# EAGLE schematic PBC-1 (EAGLE 7.1.0)
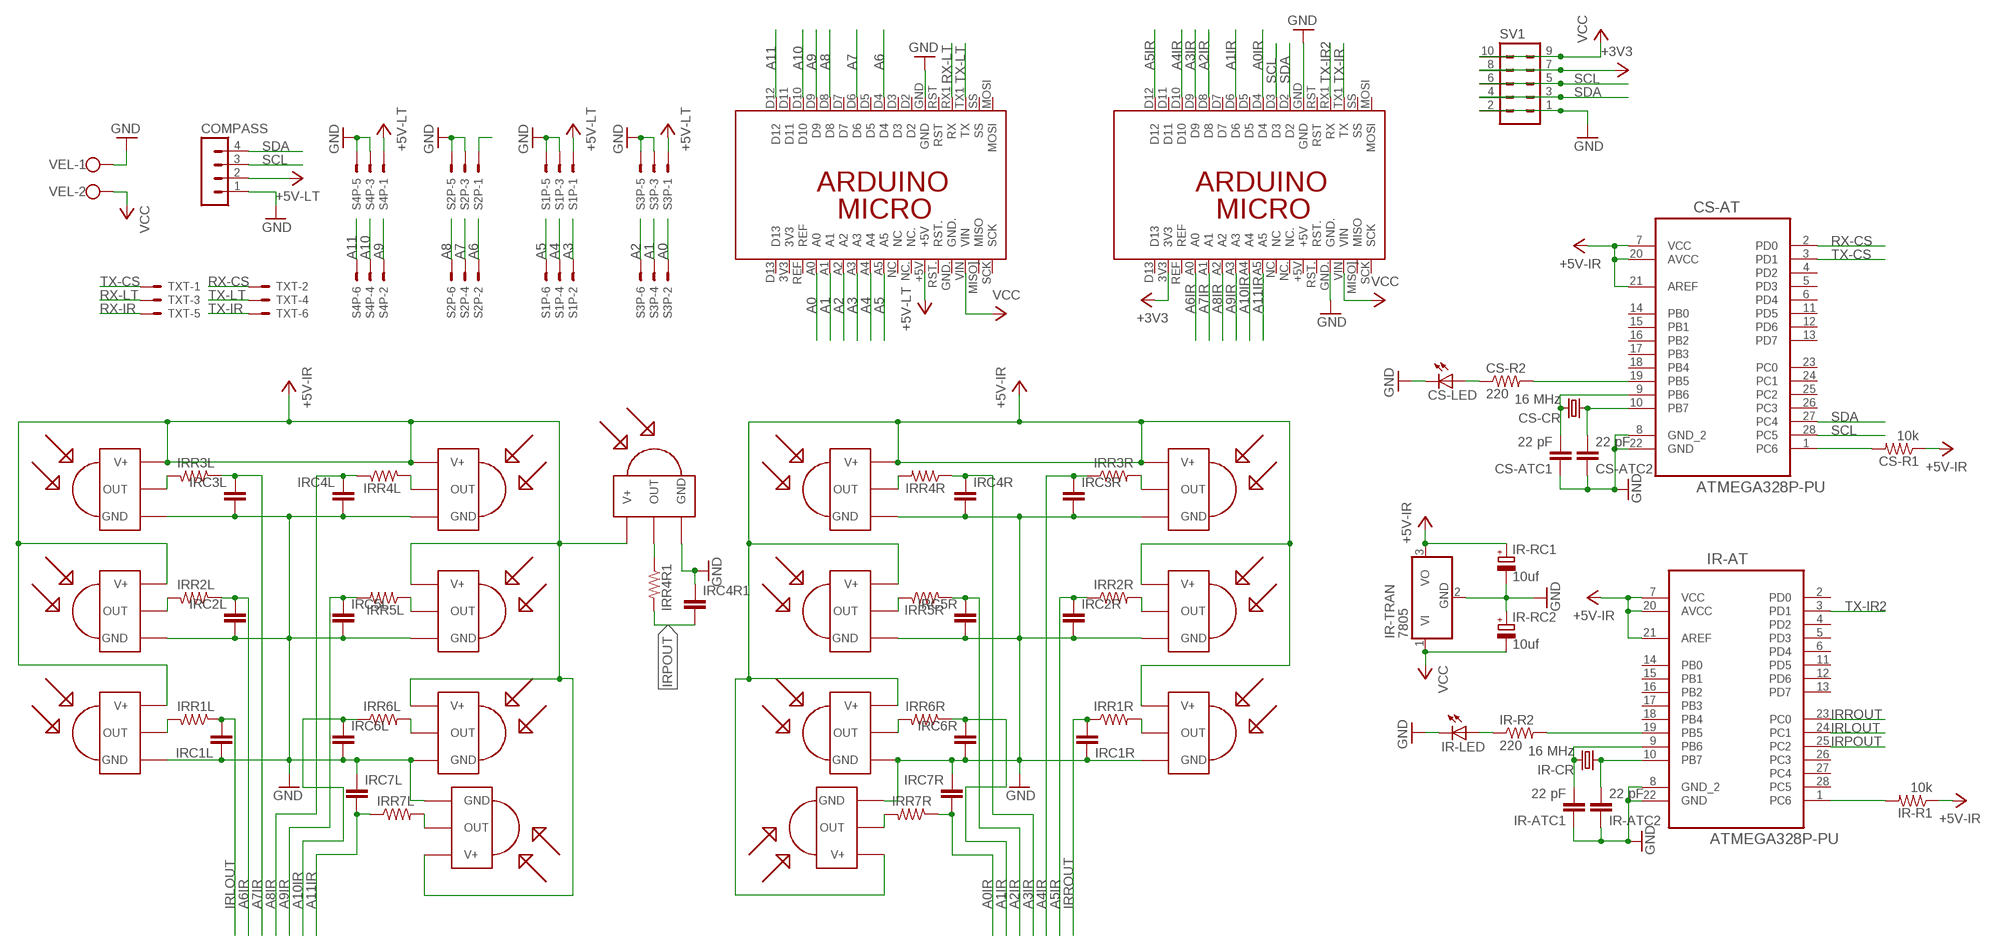
[diagram p0: schematic, sheet 1]

## Parts
COMPASS  MA04-1  [MA04-1]
CS-AT  ATMEGA328P-PU  [DIP254P762X457-28]
CS-ATC1  22 pF  C-EU025-024X044  [C025-024X044]
CS-ATC2  22 pF  C-EU025-024X044  [C025-024X044]
CS-CR  16 MHz  CRYSTALHC49U70  [HC49U70]
CS-LED  LED5MM  [LED5MM]
CS-R1  10k  R-US_0204/7  [0204/7]
CS-R2  220  R-US_0204/7  [0204/7]
IR-AT  ATMEGA328P-PU  [DIP254P762X457-28]
IR-ATC1  22 pF  C-EU025-024X044  [C025-024X044]
IR-ATC2  22 pF  C-EU025-024X044  [C025-024X044]
IR-CR  16 MHz  CRYSTALHC49U70  [HC49U70]
IR-LED  LED5MM  [LED5MM]
IR-R1  10k  R-US_0204/7  [0204/7]
IR-R2  220  R-US_0204/7  [0204/7]
IR-RC1  10uf  CPOL-EUTT2D5  [TT2D5]
IR-RC2  10uf  CPOL-EUTT2D5  [TT2D5]
IR-TRAN  7805  7805T  [TO220H]
IRC1L  C-EU025-024X044  [C025-024X044]
IRC1R  C-EU025-024X044  [C025-024X044]
IRC2L  C-EU025-024X044  [C025-024X044]
IRC2R  C-EU025-024X044  [C025-024X044]
IRC3L  C-EU025-024X044  [C025-024X044]
IRC3R  C-EU025-024X044  [C025-024X044]
IRC4L  C-EU025-024X044  [C025-024X044]
IRC4R  C-EU025-024X044  [C025-024X044]
IRC4R1  C-EU025-024X044  [C025-024X044]
IRC5L  C-EU025-024X044  [C025-024X044]
IRC5R  C-EU025-024X044  [C025-024X044]
IRC6L  C-EU025-024X044  [C025-024X044]
IRC6R  C-EU025-024X044  [C025-024X044]
IRC7L  C-EU025-024X044  [C025-024X044]
IRC7R  C-EU025-024X044  [C025-024X044]
IRD1L  TSOP2240  TSOP1840  [TSOP18XX]
IRD1R  TSOP2240  TSOP1840  [TSOP18XX]
IRD2L  TSOP2240  TSOP1840  [TSOP18XX]
IRD2R  TSOP2240  TSOP1840  [TSOP18XX]
IRD3L  TSOP2240  TSOP1840  [TSOP18XX]
IRD3R  TSOP1840  [TSOP18XX]
IRD4L  TSOP2240  TSOP1840  [TSOP18XX]
IRD4R  TSOP2240  TSOP1840  [TSOP18XX]
IRD5L  TSOP2240  TSOP1840  [TSOP18XX]
IRD5R  TSOP2240  TSOP1840  [TSOP18XX]
IRD6L  TSOP2240  TSOP1840  [TSOP18XX]
IRD6R  TSOP2240  TSOP1840  [TSOP18XX]
IRD7L  TSOP2240  TSOP1840  [TSOP18XX]
IRD7R  TSOP2240  TSOP1840  [TSOP18XX]
IRDP  TSOP2240  TSOP1840  [TSOP18XX]
IRR1L  R-US_0204/5  [0204/5]
IRR1R  R-US_0204/5  [0204/5]
IRR2L  R-US_0204/5  [0204/5]
IRR2R  R-US_0204/5  [0204/5]
IRR3L  R-US_0204/5  [0204/5]
IRR3R  R-US_0204/5  [0204/5]
IRR4L  R-US_0204/5  [0204/5]
IRR4R  R-US_0204/5  [0204/5]
IRR4R1  R-US_0204/5  [0204/5]
IRR5L  R-US_0204/5  [0204/5]
IRR5R  R-US_0204/5  [0204/5]
IRR6L  R-US_0204/5  [0204/5]
IRR6R  R-US_0204/5  [0204/5]
IRR7L  R-US_0204/5  [0204/5]
IRR7R  R-US_0204/5  [0204/5]
PCB1  ARDUINO_MICRO  [ARDUINO_MICRO]
PCB3  ARDUINO_MICRO  [ARDUINO_MICRO]
S1P  332-06  [332-06]
S2P  332-06  [332-06]
S3P  332-06  [332-06]
S4P  332-06  [332-06]
SV1  MA05-2  [MA05-2]
TXT  87758-0616  [87758-0616]
VEL  W237-102  [W237-102]

## Nets
+3V3: PCB3.3V3 SV1.7 SV1.8
+5V-IR: CS-AT.7(VCC) CS-AT.20(AVCC) CS-AT.21(AREF) CS-R1.1 IR-AT.7(VCC) IR-AT.20(AVCC) IR-AT.21(AREF) IR-R1.1 IR-RC1.+ IR-TRAN.3(VO) IRD1L.VCC(V+) IRD1R.VCC(V+) IRD2L.VCC(V+) IRD2R.VCC(V+) IRD3L.VCC(V+) IRD3R.VCC(V+) IRD4L.VCC(V+) IRD4R.VCC(V+) IRD5L.VCC(V+) IRD5R.VCC(V+) IRD6L.VCC(V+) IRD6R.VCC(V+) IRD7L.VCC(V+) IRD7R.VCC(V+) IRDP.VCC(V+)
+5V-LT: COMPASS.2 PCB1.+5V S1P.1 S3P.1 S4P.1
A0: PCB1.A0 S3P.2
A0IR: IRC7R.2 IRR7R.1 PCB3.D4
A1: PCB1.A1 S3P.4
A1IR: IRC6R.1 IRR6R.1 PCB3.D6
A2: PCB1.A2 S3P.6
A2IR: IRC5R.1 IRR5R.2 PCB3.D8
A3: PCB1.A3 S1P.2
A3IR: IRC4R.1 IRR4R.1 PCB3.D9
A4: PCB1.A4 S1P.4
A4IR: IRC3R.1 IRR3R.1 PCB3.D10
A5: PCB1.A5 S1P.6
A5IR: IRC2R.1 IRR2R.1 PCB3.D12
A6: PCB1.D4 S2P.2
A6IR: IRC2L.1 IRR2L.1 PCB3.A0
A7: PCB1.D6 S2P.4
A7IR: IRC3L.1 IRR3L.1 PCB3.A1
A8: PCB1.D8 S2P.6
A8IR: IRC4L.1 IRR4L.1 PCB3.A2
A9: PCB1.D9 S4P.2
A9IR: IRC5L.1 IRR5L.2 PCB3.A3
A10: PCB1.D10 S4P.4
A10IR: IRC6L.1 IRR6L.1 PCB3.A4
A11: PCB1.D12 S4P.6
A11IR: IRC7L.2 IRR7L.1 PCB3.A5
GND: COMPASS.1 CS-AT.8(GND_2) CS-AT.22(GND) CS-ATC1.1 CS-ATC2.1 CS-LED.K(C) IR-AT.8(GND_2) IR-AT.22(GND) IR-ATC1.1 IR-ATC2.1 IR-LED.K(C) IR-RC1.- IR-RC2.+ IR-TRAN.2(GND) IRC1L.1 IRC1R.1 IRC2L.2 IRC2R.2 IRC3L.2 IRC3R.2 IRC4L.2 IRC4R1.1 IRC4R.2 IRC5L.2 IRC5R.2 IRC6L.2 IRC6R.2 IRC7L.1 IRC7R.1 IRD1L.GND IRD1R.GND IRD2L.GND IRD2R.GND IRD3L.GND IRD3R.GND IRD4L.GND IRD4R.GND IRD5L.GND IRD5R.GND IRD6L.GND IRD6R.GND IRD7L.GND IRD7R.GND IRDP.GND PCB1.GND PCB3.GND PCB3.GND. S1P.3 S1P.5 S2P.3 S2P.5 S3P.3 S3P.5 S4P.3 S4P.5 SV1.1 SV1.2 VEL.1
IR-CR: IR-AT.9(PB6) IR-ATC1.2 IR-CR.2
IRLOUT: IR-AT.24(PC1) IRC1L.2 IRR1L.1
IRPOUT: IR-AT.25(PC2) IRC4R1.2 IRR4R1.2
IRROUT: IR-AT.23(PC0) IRC1R.2 IRR1R.1
N$1: IR-LED.A IR-R2.1
N$2: IR-AT.19(PB5) IR-R2.2
N$4: IRD4R.OUT IRR4R.2
N$7: IRD7R.OUT IRR7R.2
N$8: IRD5R.OUT IRR5R.1
N$9: IRD2R.OUT IRR2R.2
N$11: IRD3R.OUT IRR3R.2
N$13: IRD1R.OUT IRR1R.2
N$14: IRD6R.OUT IRR6R.2
N$20: IRD3L.OUT IRR3L.2
N$21: IRD2L.OUT IRR2L.2
N$23: IRD1L.OUT IRR1L.2
N$24: IRD4L.OUT IRR4L.2
N$25: IRD5L.OUT IRR5L.1
N$27: IRD6L.OUT IRR6L.2
N$29: IRD7L.OUT IRR7L.2
N$32: S2P.1
N$33: IRDP.OUT IRR4R1.1
N$34: CS-LED.A CS-R2.1
N$35: CS-AT.19(PB5) CS-R2.2
PB6-A3: CS-AT.9(PB6) CS-ATC1.2 CS-CR.2
PB7-A1: IR-AT.10(PB7) IR-ATC2.2 IR-CR.1
PB7-A3: CS-AT.10(PB7) CS-ATC2.2 CS-CR.1
RESET-AT1: IR-AT.1(PC6) IR-R1.2
RESET-AT3: CS-AT.1(PC6) CS-R1.2
RX-CS: CS-AT.2(PD0) TXT.2
RX-IR: TXT.5
RX-LT: PCB1.RX1(RX) TXT.3
SCL: COMPASS.3 CS-AT.28(PC5) PCB3.D3 SV1.5 SV1.6
SDA: COMPASS.4 CS-AT.27(PC4) PCB3.D2 SV1.3 SV1.4
TX-CS: CS-AT.3(PD1) TXT.1
TX-IR: PCB3.TX1(TX) TXT.6
TX-IR2: IR-AT.3(PD1) PCB3.RX1(RX)
TX-LT: PCB1.TX1(TX) TXT.4
VCC: IR-RC2.- IR-TRAN.1(VI) PCB1.VIN PCB3.VIN SV1.9 SV1.10 VEL.2
Unconnected: CS-AT.4(PD2) CS-AT.5(PD3) CS-AT.6(PD4) CS-AT.11(PD5) CS-AT.12(PD6) CS-AT.13(PD7) CS-AT.14(PB0) CS-AT.15(PB1) CS-AT.16(PB2) CS-AT.17(PB3) CS-AT.18(PB4) CS-AT.23(PC0) CS-AT.24(PC1) CS-AT.25(PC2) CS-AT.26(PC3) IR-AT.2(PD0) IR-AT.4(PD2) IR-AT.5(PD3) IR-AT.6(PD4) IR-AT.11(PD5) IR-AT.12(PD6) IR-AT.13(PD7) IR-AT.14(PB0) IR-AT.15(PB1) IR-AT.16(PB2) IR-AT.17(PB3) IR-AT.18(PB4) IR-AT.26(PC3) IR-AT.27(PC4) IR-AT.28(PC5) PCB1.3V3 PCB1.D2 PCB1.D3 PCB1.D5 PCB1.D7 PCB1.D11 PCB1.D13 PCB1.GND. PCB1.MISO](MISO) PCB1.MOSI PCB1.NC PCB1.NC. PCB1.REF PCB1.RST PCB1.RST. PCB1.SCK PCB1.SS PCB3.+5V PCB3.D5 PCB3.D7 PCB3.D11 PCB3.D13 PCB3.MISO](MISO) PCB3.MOSI PCB3.NC PCB3.NC. PCB3.REF PCB3.RST PCB3.RST. PCB3.SCK PCB3.SS

## Library data of the parts
COMPASS = con-lstb:MA04-1: PIN HEADER; OC_FARNELL: unknown; OC_NEWARK: unknown
CS-AT IR-AT = Atmel_By_element14_Batch_1-00:ATMEGA328P-PU: 8-bit Microcontroller with In-System Programmable Flash; MPN: ATMEGA328P-PU; OC_FARNELL: 1715487; OC_NEWARK: 15R0268; PACKAGE: PDIP-28; SUPPLIER: Atmel
CS-ATC1 CS-ATC2 IR-ATC1 IR-ATC2 IRC1L IRC1R IRC2L IRC2R IRC3L IRC3R IRC4L IRC4R IRC4R1 IRC5L IRC5R IRC6L IRC6R IRC7L IRC7R = rcl:C-EU: CAPACITOR, European symbol
CS-CR IR-CR = crystal:CRYSTAL: CRYSTAL; OC_FARNELL: unknown; OC_NEWARK: unknown
CS-LED IR-LED = led:LED: LED OSRAM: - CHIPLED LG R971, LG N971, LY N971, LG Q971, LY Q971, LO R971, LY R971 LH N974, LH R974 LS Q976, LO Q976, LY Q976 LO Q996 - Hyper CHIPLED LW Q18S LB Q993, LB Q99A, LB R99A - SideLED LS A670, LO A670, LY A670, LG A670, LP A670 LB A673, LV A673, LT A673, LW A673 LH A674 LY A675 LS A676, LA A676, LO A676, LY A676, LW A676 LS A679, LY A679, LG A679 - Hyper Micro SIDELED® LS Y876, LA Y876, LO Y876, LY Y876 LT Y87S - SmartLED LW L88C, LW L88S LB L89C, LB L89S, LG L890 LS L89K, LO L89K, LY L89K LS L896, LA L896, LO L896, LY L896 - TOPLED LS T670, LO T670, LY T670, LG T670, LP T670 LSG T670, LSP T670, LSY T670, LOP T670, LYG T670 LG T671, LOG T671, LSG T671 LB T673, LV T673, LT T673, LW T673 LH T674 LS T676, LA T676, LO T676, LY T676, LB T676, LH T676, LSB T676, LW T676 LB T67C, LV T67C, LT T67C, LS T67K, LO T67K, LY T67K, LW E67C LS E67B, LA E67B, LO E67B, LY E67B, LB E67C, LV E67C, LT E67C LW T67C LS T679, LY T679, LG T679 LS T770, LO T770, LY T770, LG T770, LP T770 LB T773, LV T773, LT T773, LW T773 LH T774 LS E675, LA E675, LY E675, LS T675 LS T776, LA T776, LO T776, LY T776, LB T776 LHGB T686 LT T68C, LB T68C - Hyper Mini TOPLED® LB M676 - Mini TOPLED Santana® LG M470 LS M47K, LO M47K, LY M47K Source: http://www.osram.convergy.de LUXEON: - LUMILED® LXK2-PW12-R00, LXK2-PW12-S00, LXK2-PW14-U00, LXK2-PW14-V00 LXK2-PM12-R00, LXK2-PM12-S00, LXK2-PM14-U00 LXK2-PE12-Q00, LXK2-PE12-R00, LXK2-PE12-S00, LXK2-PE14-T00, LXK2-PE14-U00 LXK2-PB12-K00, LXK2-PB12-L00, LXK2-PB12-M00, LXK2-PB14-N00, LXK2-PB14-P00, LXK2-PB14-Q00 LXK2-PR12-L00, LXK2-PR12-M00, LXK2-PR14-Q00, LXK2-PR14-R00 LXK2-PD12-Q00, LXK2-PD12-R00, LXK2-PD12-S00 LXK2-PH12-R00, LXK2-PH12-S00 LXK2-PL12-P00, LXK2-PL12-Q00, LXK2-PL12-R00 Source: www.luxeon.com KINGBRIGHT: KA-3528ASYC Source: www.kingbright.com
CS-R1 CS-R2 IR-R1 IR-R2 IRR1L IRR1R IRR2L IRR2R IRR3L IRR3R IRR4L IRR4R IRR4R1 IRR5L IRR5R IRR6L IRR6R IRR7L IRR7R = rcl:R-US_: RESISTOR, American symbol
IR-RC1 IR-RC2 = resistor:CPOL-EU: POLARIZED CAPACITOR, European symbol
IR-TRAN = linear:78*: Positive VOLTAGE REGULATOR Source: http://cache.national.com/ds/LM/LM78L05.pdf http://www.fairchildsemi.com/ds/LM/LM7805.pdf
IRD1L IRD1R IRD2L IRD2R IRD3L IRD3R IRD4L IRD4R IRD5L IRD5R IRD6L IRD6R IRD7L IRD7R IRDP = tsop:TSOP1840: IR Receiver and Demodulator
PCB1 PCB3 = E14_Arduino_revB:ARDUINO_MICRO: Device for representing an Arduino Micro board with a footprint in an EAGLE design. Created by Dave Young for Element14. More EAGLE documentation at: http://www.element14.com/community/community/knode/cadsoft_eagle
S1P S2P S3P S4P = con-garry:332-06: 6 Pin - 2mm Dual Row Source: www.mpe-connector.de / garry_shortform_2012.pdf
SV1 = con-lstb:MA05-2: PIN HEADER; OC_FARNELL: unknown; OC_NEWARK: unknown
TXT = con-molex:87758-0616: 6 Pin - 2mm Dual Row Single Wafer, Vertical T/H HDR Source: http://www.molex.com/pdm_docs/sd/877580616_sd.pdf; MPN: 87758-0616; OC_FARNELL: 7472323; OC_NEWARK: 25M5667
VEL = con-wago-500:W237-102: WAGO SCREW CLAMP; MPN: 237-102; OC_FARNELL: unknown; OC_NEWARK: 70K9898